# EAGLE schematic модель 1 (EAGLE 9.4.2)
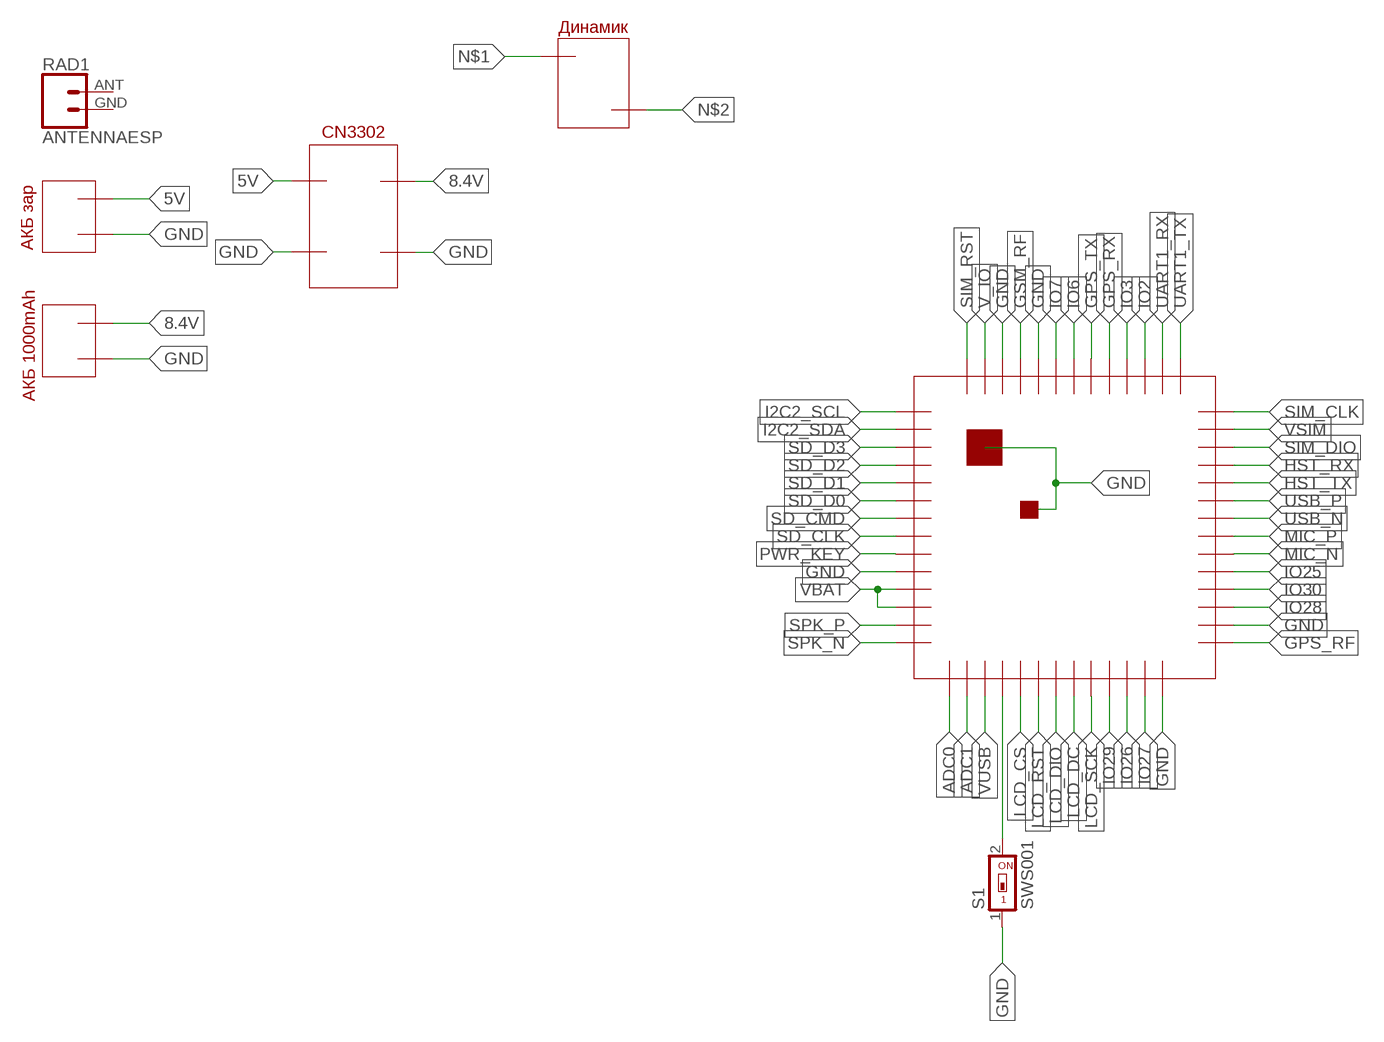
[diagram p0: schematic, sheet 1]

## Parts
RAD1  ANTENNAESP  [2.4GHZ]
S1  SWS001  [SMS-001]

## Nets
GND: S1.1
RESET: S1.2
Unconnected: RAD1.ANT(ANTENNA) RAD1.GND

## Notes on the sheet
- Динамик
- CN3302
- АКБ зар
- АКБ 1000mAh

## Library data of the parts
RAD1 = LARS_409_RADIO:ANTENNA
S1 = smd-special:SWS001: SMD Dip Switch 1 pol.